# EAGLE design BreadShieldUno (EAGLE 7.1.0)
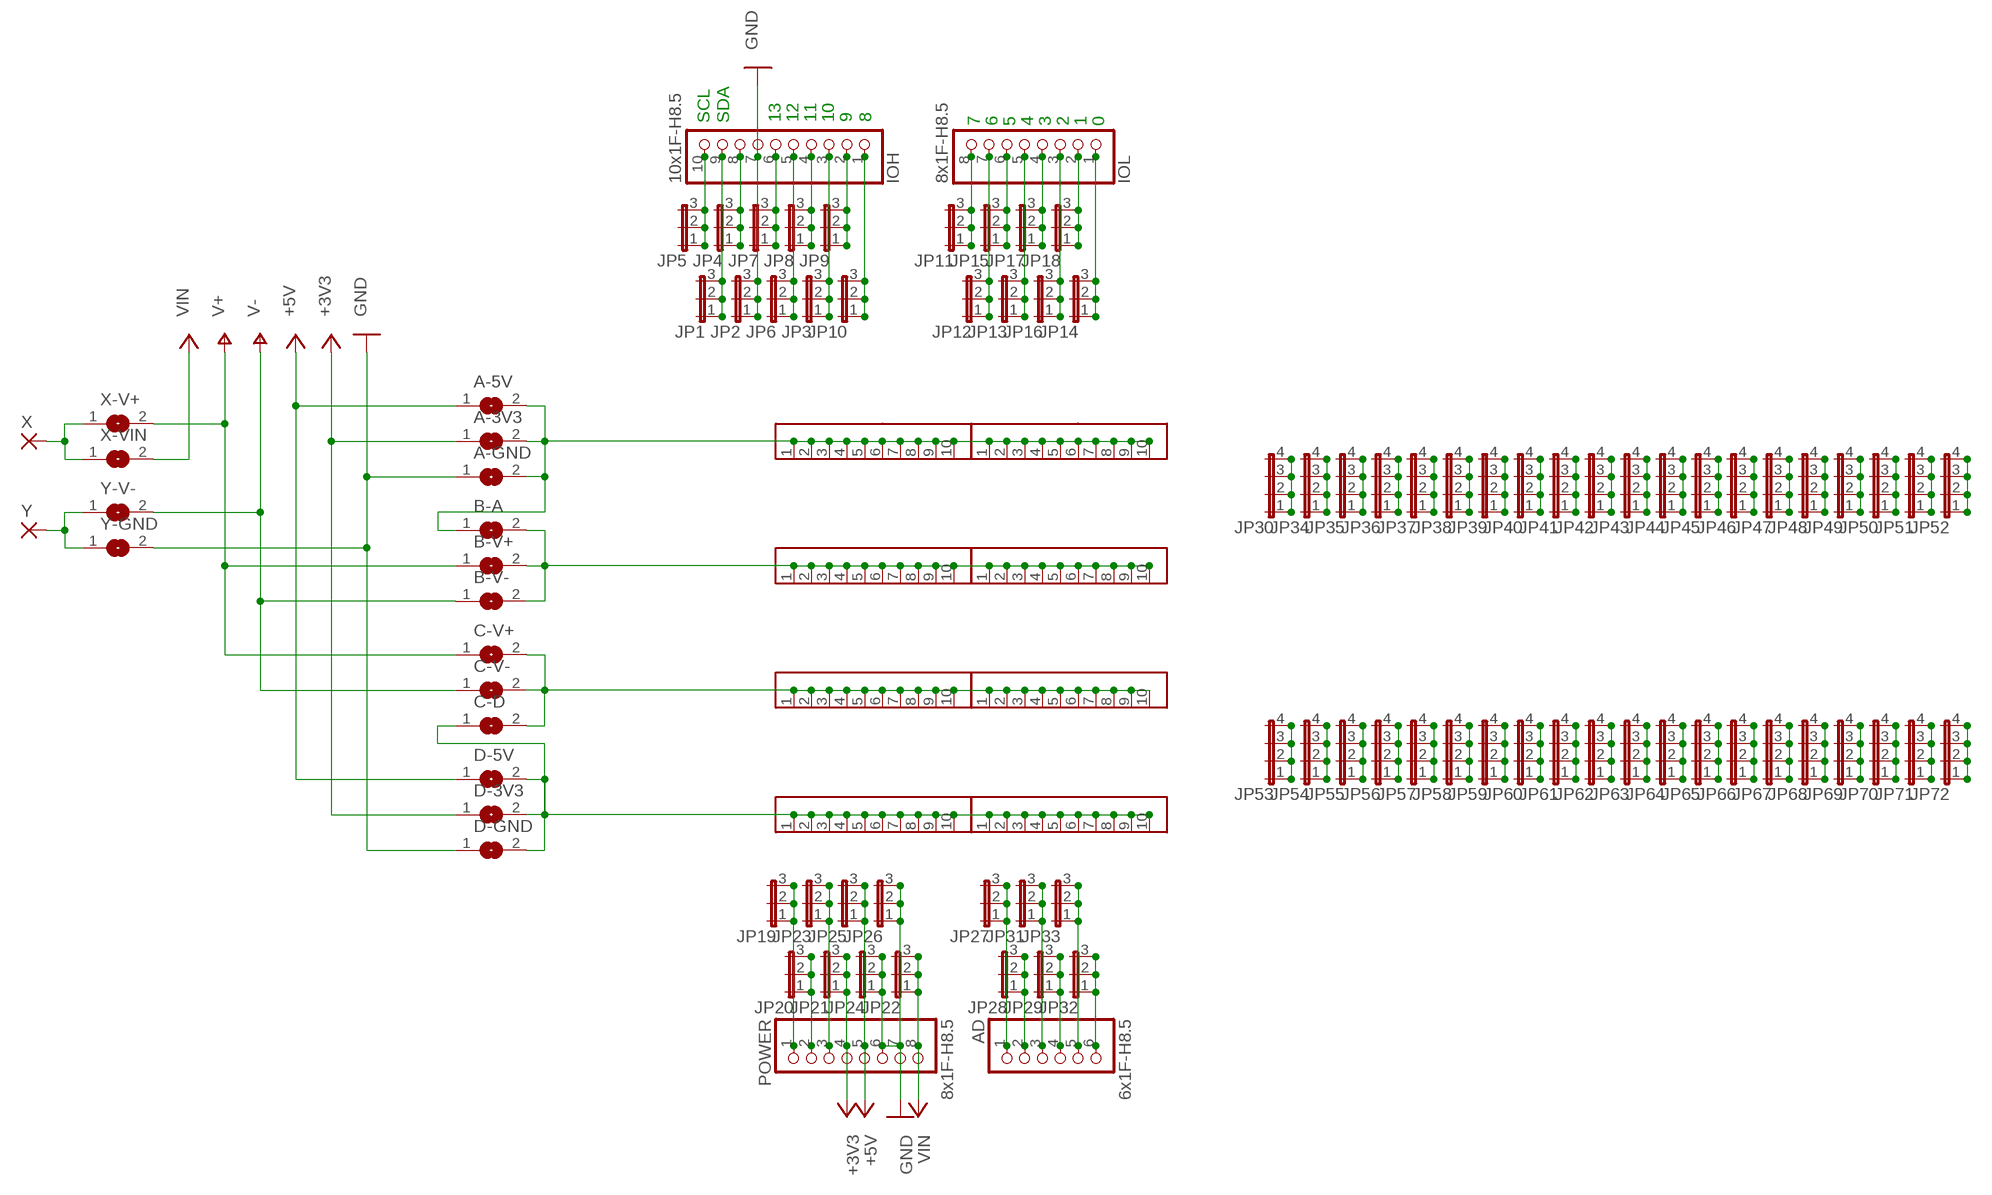
[diagram p0: schematic, sheet 1]

## Parts
A  JP10B  [JP10-1]
A2  JP10B  [JP10-1]
A-3V3  SJ  [SJ]
A-5V  SJ  [SJ]
A-GND  SJ  [SJ]
AD  6x1F-H8.5  PINHD-1X6  [1X06]
B  JP10B  [JP10-1]
B2  JP10B  [JP10-1]
B-A  SJ  [SJ]
B-V+  SJ  [SJ]
B-V-  SJ  [SJ]
C  JP10B  [JP10-1]
C2  JP10B  [JP10-1]
C-D  SJ  [SJ]
C-V+  SJ  [SJ]
C-V-  SJ  [SJ]
D  JP10B  [JP10-1]
D2  JP10B  [JP10-1]
D-3V3  SJ  [SJ]
D-5V  SJ  [SJ]
D-GND  SJ  [SJ]
IOH  10x1F-H8.5  PINHD-1X10_ARD  [1X10]
IOL  8x1F-H8.5  PINHD-1X8  [1X08]
JP1  JP2E  [JP2]
JP2  JP2E  [JP2]
JP3  JP2E  [JP2]
JP4  JP2E  [JP2]
JP5  JP2E  [JP2]
JP6  JP2E  [JP2]
JP7  JP2E  [JP2]
JP8  JP2E  [JP2]
JP9  JP2E  [JP2]
JP10  JP2E  [JP2]
JP11  JP2E  [JP2]
JP12  JP2E  [JP2]
JP13  JP2E  [JP2]
JP14  JP2E  [JP2]
JP15  JP2E  [JP2]
JP16  JP2E  [JP2]
JP17  JP2E  [JP2]
JP18  JP2E  [JP2]
JP19  JP2E  [JP2]
JP20  JP2E  [JP2]
JP21  JP2E  [JP2]
JP22  JP2E  [JP2]
JP23  JP2E  [JP2]
JP24  JP2E  [JP2]
JP25  JP2E  [JP2]
JP26  JP2E  [JP2]
JP27  JP2E  [JP2]
JP28  JP2E  [JP2]
JP29  JP2E  [JP2]
JP30  JP4E  [JP4]
JP31  JP2E  [JP2]
JP32  JP2E  [JP2]
JP33  JP2E  [JP2]
JP34  JP4E  [JP4]
JP35  JP4E  [JP4]
JP36  JP4E  [JP4]
JP37  JP4E  [JP4]
JP38  JP4E  [JP4]
JP39  JP4E  [JP4]
JP40  JP4E  [JP4]
JP41  JP4E  [JP4]
JP42  JP4E  [JP4]
JP43  JP4E  [JP4]
JP44  JP4E  [JP4]
JP45  JP4E  [JP4]
JP46  JP4E  [JP4]
JP47  JP4E  [JP4]
JP48  JP4E  [JP4]
JP49  JP4E  [JP4]
JP50  JP4E  [JP4]
JP51  JP4E  [JP4]
JP52  JP4E  [JP4]
JP53  JP4E  [JP4]
JP54  JP4E  [JP4]
JP55  JP4E  [JP4]
JP56  JP4E  [JP4]
JP57  JP4E  [JP4]
JP58  JP4E  [JP4]
JP59  JP4E  [JP4]
JP60  JP4E  [JP4]
JP61  JP4E  [JP4]
JP62  JP4E  [JP4]
JP63  JP4E  [JP4]
JP64  JP4E  [JP4]
JP65  JP4E  [JP4]
JP66  JP4E  [JP4]
JP67  JP4E  [JP4]
JP68  JP4E  [JP4]
JP69  JP4E  [JP4]
JP70  JP4E  [JP4]
JP71  JP4E  [JP4]
JP72  JP4E  [JP4]
POWER  8x1F-H8.5  PINHD-1X8  [1X08]
X  3,81/1,4  [3,81/1,4]
X-V+  SJ  [SJ]
X-VIN  SJ  [SJ]
Y  3,81/1,4  [3,81/1,4]
Y-GND  SJ  [SJ]
Y-V-  SJ  [SJ]

## Nets
+3V3: A-3V3.1 D-3V3.1 JP21.1 JP21.2 JP21.3 POWER.4
+5V: A-5V.1 D-5V.1 JP25.1 JP25.2 JP25.3 POWER.5
GND: A-GND.1 D-GND.1 IOH.7 JP2.1 JP2.2 JP2.3 JP24.1 JP24.2 JP24.3 JP26.1 JP26.2 JP26.3 POWER.6 POWER.7 Y-GND.2
GND1: IOL.5 JP13.1 JP13.2 JP13.3
GND2: AD.4 JP29.1 JP29.2 JP29.3
N$1: A2.1 A2.2 A2.3 A2.4 A2.5 A2.6 A2.7 A2.8 A2.9 A2.10 A-3V3.2 A-5V.2 A-GND.2 A.1 A.2 A.3 A.4 A.5 A.6 A.7 A.8 A.9 A.10 B-A.1
N$2: B2.1 B2.2 B2.3 B2.4 B2.5 B2.6 B2.7 B2.8 B2.9 B2.10 B-A.2 B-V+.2 B-V-.2 B.1 B.2 B.3 B.4 B.5 B.6 B.7 B.8 B.9 B.10
N$3: C2.1 C2.2 C2.3 C2.4 C2.5 C2.6 C2.7 C2.8 C2.9 C2.10 C-D.2 C-V+.2 C-V-.2 C.1 C.2 C.3 C.4 C.5 C.6 C.7 C.8 C.9 C.10
N$4: C-D.1 D2.1 D2.2 D2.3 D2.4 D2.5 D2.6 D2.7 D2.8 D2.9 D2.10 D-3V3.2 D-5V.2 D-GND.2 D.1 D.2 D.3 D.4 D.5 D.6 D.7 D.8 D.9 D.10
N$5: X-V+.1 X-VIN.1 X.1(P)
N$6: Y-GND.1 Y-V-.1 Y.1(P)
N$7: IOH.10 JP5.1 JP5.2 JP5.3
N$8: IOH.9 JP1.1 JP1.2 JP1.3
N$9: IOH.8 JP4.1 JP4.2 JP4.3
N$10: IOH.6 JP7.1 JP7.2 JP7.3
N$11: IOH.5 JP6.1 JP6.2 JP6.3
N$12: IOH.4 JP8.1 JP8.2 JP8.3
N$13: IOH.3 JP3.1 JP3.2 JP3.3
N$14: IOH.2 JP9.1 JP9.2 JP9.3
N$15: IOH.1 JP10.1 JP10.2 JP10.3
N$16: IOL.8 JP11.1 JP11.2 JP11.3
N$17: IOL.7 JP12.1 JP12.2 JP12.3
N$18: IOL.6 JP15.1 JP15.2 JP15.3
N$19: IOL.4 JP17.1 JP17.2 JP17.3
N$20: IOL.3 JP16.1 JP16.2 JP16.3
N$21: IOL.2 JP18.1 JP18.2 JP18.3
N$22: IOL.1 JP14.1 JP14.2 JP14.3
N$23: JP19.1 JP19.2 JP19.3 POWER.1
N$24: JP20.1 JP20.2 JP20.3 POWER.2
N$25: JP23.1 JP23.2 JP23.3 POWER.3
N$26: AD.1 JP27.1 JP27.2 JP27.3
N$27: AD.2 JP28.1 JP28.2 JP28.3
N$28: AD.3 JP31.1 JP31.2 JP31.3
N$29: AD.5 JP33.1 JP33.2 JP33.3
N$30: AD.6 JP32.1 JP32.2 JP32.3
N$31: JP30.1 JP30.2 JP30.3 JP30.4
N$32: JP34.1 JP34.2 JP34.3 JP34.4
N$33: JP35.1 JP35.2 JP35.3 JP35.4
N$34: JP36.1 JP36.2 JP36.3 JP36.4
N$35: JP37.1 JP37.2 JP37.3 JP37.4
N$36: JP38.1 JP38.2 JP38.3 JP38.4
N$37: JP39.1 JP39.2 JP39.3 JP39.4
N$38: JP40.1 JP40.2 JP40.3 JP40.4
N$39: JP41.1 JP41.2 JP41.3 JP41.4
N$40: JP42.1 JP42.2 JP42.3 JP42.4
N$41: JP43.1 JP43.2 JP43.3 JP43.4
N$42: JP44.1 JP44.2 JP44.3 JP44.4
N$43: JP45.1 JP45.2 JP45.3 JP45.4
N$44: JP46.1 JP46.2 JP46.3 JP46.4
N$45: JP47.1 JP47.2 JP47.3 JP47.4
N$46: JP48.1 JP48.2 JP48.3 JP48.4
N$47: JP49.1 JP49.2 JP49.3 JP49.4
N$48: JP50.1 JP50.2 JP50.3 JP50.4
N$49: JP51.1 JP51.2 JP51.3 JP51.4
N$50: JP52.1 JP52.2 JP52.3 JP52.4
N$51: JP53.1 JP53.2 JP53.3 JP53.4
N$52: JP54.1 JP54.2 JP54.3 JP54.4
N$53: JP55.1 JP55.2 JP55.3 JP55.4
N$54: JP56.1 JP56.2 JP56.3 JP56.4
N$55: JP57.1 JP57.2 JP57.3 JP57.4
N$56: JP58.1 JP58.2 JP58.3 JP58.4
N$57: JP59.1 JP59.2 JP59.3 JP59.4
N$58: JP60.1 JP60.2 JP60.3 JP60.4
N$59: JP61.1 JP61.2 JP61.3 JP61.4
N$60: JP62.1 JP62.2 JP62.3 JP62.4
N$61: JP63.1 JP63.2 JP63.3 JP63.4
N$62: JP64.1 JP64.2 JP64.3 JP64.4
N$63: JP65.1 JP65.2 JP65.3 JP65.4
N$64: JP66.1 JP66.2 JP66.3 JP66.4
N$65: JP67.1 JP67.2 JP67.3 JP67.4
N$66: JP68.1 JP68.2 JP68.3 JP68.4
N$67: JP69.1 JP69.2 JP69.3 JP69.4
N$68: JP70.1 JP70.2 JP70.3 JP70.4
N$69: JP71.1 JP71.2 JP71.3 JP71.4
N$70: JP72.1 JP72.2 JP72.3 JP72.4
V+: B-V+.1 C-V+.1 X-V+.2
V-: B-V-.1 C-V-.1 Y-V-.2
VIN: JP22.1 JP22.2 JP22.3 POWER.8 X-VIN.2

## Notes on the sheet
- SCL | SDA | 13 | 12 | 11 | 10 | 9 | 8 | 7 | 6 | 5 | 4 | 3 | 2 | 1 | 0

## Library data of the parts
A A2 B B2 C C2 D D2 = jumper:JP10B
A-3V3 A-5V A-GND B-A B-V+ B-V- C-D C-V+ C-V- D-3V3 D-5V D-GND X-V+ X-VIN Y-GND Y-V- = jumper:SJ: SMD solder JUMPER
AD = SmartPrj:PINHD-1X6: PIN HEADER
IOH = SmartPrj:PINHD-1X10_ARD: PIN HEADER
IOL POWER = SmartPrj:PINHD-1X8: PIN HEADER
JP1-JP29 JP31-JP33 = jumper:JP2E: JUMPER
JP30 JP34-JP72 = jumper:JP4E: JUMPER
X Y = wirepad:3,81/1,4: THROUGH-HOLE PAD

## Net classes
0 default: width 0.254 mm, clearance 0.254 mm
1 power: width 0.61 mm, drill 0.61 mm, clearance 0.254 mm
2 gnd: width 0.305 mm, drill 0.559 mm, clearance 0.254 mm
3 usbvcc: width 0.508 mm, drill 0.61 mm, clearance 0.254 mm
4 aref: width 0.406 mm, drill 0.61 mm, clearance 0.254 mm

## Board
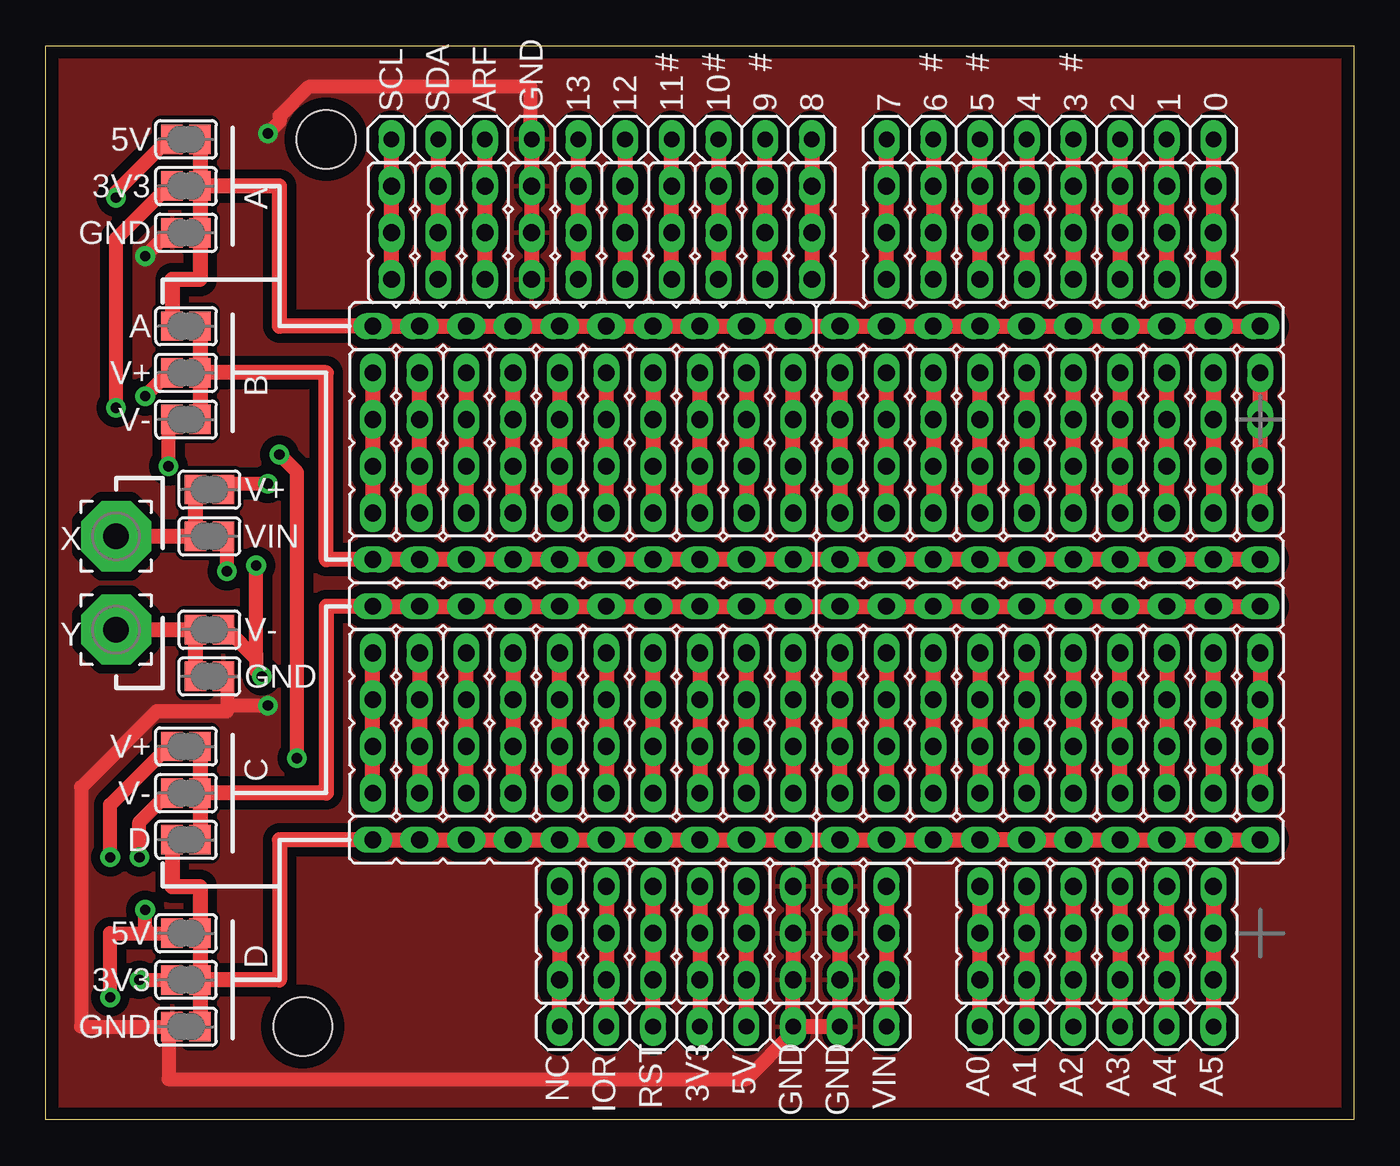
[diagram p1: board, top side]
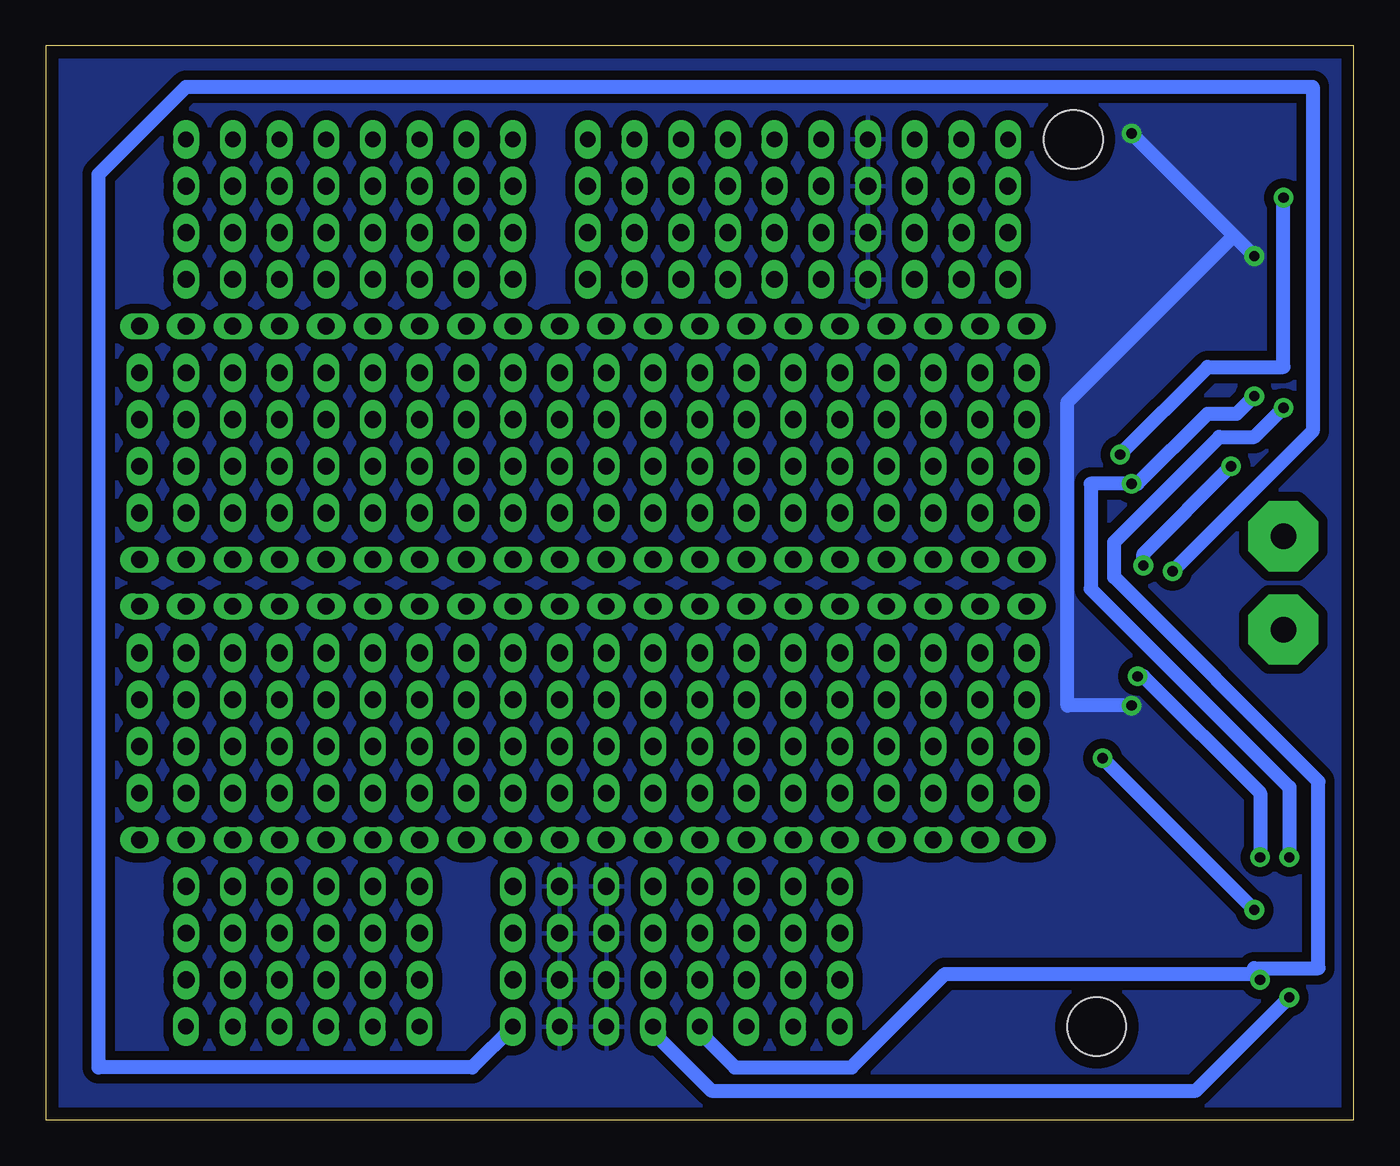
[diagram p2: board, bottom side, seen from below]

Size 71.12 x 58.42 mm. Coordinates in mm from the lower left corner, seen from the top.
Outline: 0,0 0,58.42 71.12,58.42 71.12,0 0,0
Copper layers (1*16): Top 0.035mm / dielectric 1.5mm / Bottom 0.035mm
Design rules "default *": minimum track width 30mil, minimum drill 22mil, track to track 20mil, track to pad 20mil, pad to pad 10mil, via to via 12mil, smd to smd 8mil, copper to edge 26mil, drill to drill 12mil, minimum pad ring 10mil, minimum via ring 10mil, stop-mask expansion 1mil, vias tented up to drill 30mil, thermal gap 10mil
Holes 3.2 mm at 15.24,53.34 13.97,5.08
vRestrict: area 22.9,46.6 to 24.6,51.7; area 25.4,48 to 27.1,51.7; area 28.4,47.9 to 29.6,51.3; area 31,47.9 to 32.1,51.3; area 33.5,47.9 to 34.7,51.3; area 36.1,47.9 to 37.2,51.3; area 38.7,49.8 to 39.9,51.3; area 40.3,47.6 to 47.6,49.4; area 60.3,46.7 to 61.7,49.3; area 62.9,46.7 to 64.3,49.3; area 61.3,38.4 to 64.8,39.8; area 0.6,24.4 to 2,32.6; 14 more areas

### Footprints (pad centres in the part's own frame; a part is rotated, then mirrored left to right if it is on the bottom)
JP10-1 = drill 0.914 long: 1 -10.16,0; 2 -7.62,0; 3 -5.08,0; 4 -2.54,0; 5 0,0; 6 2.54,0; 7 5.08,0; 8 7.62,0; 9 10.16,0; 10 12.7,0
SJ = smd 1.168 x 1.6: 1 -0.762,0; 2 0.762,0
1X06 = drill 0.85 pad 1.422 long: 1 -6.35,0; 2 -3.81,0; 3 -1.27,0; 4 1.27,0; 5 3.81,0; 6 6.35,0
1X10 = drill 0.85 pad 1.422 long: 1 -11.43,0; 2 -8.89,0; 3 -6.35,0; 4 -3.81,0; 5 -1.27,0; 6 1.27,0; 7 3.81,0; 8 6.35,0; 9 8.89,0; 10 11.43,0
1X08 = drill 0.85 pad 1.422 long: 1 -8.89,0; 2 -6.35,0; 3 -3.81,0; 4 -1.27,0; 5 1.27,0; 6 3.81,0; 7 6.35,0; 8 8.89,0
JP2 = drill 0.914 long: 1 -2.54,0; 2 0,0; 3 2.54,0
JP4 = drill 0.914 long: 1 -3.81,0; 2 -1.27,0; 3 1.27,0; 4 3.81,0
3,81/1,4 = drill 1.397 pad 3.81 octagon: 1 0,0

### Placement (x,y rotation side)
A  27.94,43.18 0 top
A2  53.34,43.18 0 top
A-3V3  7.62,50.8 0 top
A-5V  7.62,53.34 0 top
A-GND  7.62,48.26 0 top
AD  57.15,5.08 0 top
B  27.94,30.48 0 top
B2  53.34,30.48 0 top
B-A  7.62,43.18 0 top
B-V+  7.62,40.64 0 top
B-V-  7.62,38.1 0 top
C  27.94,27.94 0 top
C2  53.34,27.94 0 top
C-D  7.62,15.24 0 top
C-V+  7.62,20.32 0 top
C-V-  7.62,17.78 0 top
D  27.94,15.24 0 top
D2  53.34,15.24 0 top
D-3V3  7.62,7.62 0 top
D-5V  7.62,10.16 0 top
D-GND  7.62,5.08 0 top
IOH  30.23,53.34 180 top
IOL  54.61,53.34 180 top
JP1  21.34,48.26 90 top
JP2  26.42,48.26 90 top
JP3  36.58,48.26 90 top
JP4  23.88,48.26 90 top
JP5  18.8,48.26 90 top
JP6  31.5,48.26 90 top
JP7  28.96,48.26 90 top
JP8  34.04,48.26 90 top
JP9  39.12,48.26 90 top
JP10  41.66,48.26 90 top
JP11  45.72,48.26 90 top
JP12  48.26,48.26 90 top
JP13  53.34,48.26 90 top
JP14  63.5,48.26 90 top
JP15  50.8,48.26 90 top
JP16  58.42,48.26 90 top
JP17  55.88,48.26 90 top
JP18  60.96,48.26 90 top
JP19  27.94,10.16 90 top
JP20  30.48,10.16 90 top
JP21  35.56,10.16 90 top
JP22  45.72,10.16 270 top
JP23  33.02,10.16 90 top
JP24  40.64,10.16 270 top
JP25  38.1,10.16 90 top
JP26  43.18,10.16 90 top
JP27  50.8,10.16 90 top
JP28  53.34,10.16 90 top
JP29  58.42,10.16 90 top
JP30  17.78,36.83 90 top
JP31  55.88,10.16 90 top
JP32  63.5,10.16 90 top
JP33  60.96,10.16 90 top
JP34  20.32,36.83 90 top
JP35  22.86,36.83 90 top
JP36  17.78,21.59 90 top
JP37  20.32,21.59 90 top
JP38  22.86,21.59 90 top
JP39  25.4,21.59 90 top
JP40  27.94,21.59 90 top
JP41  30.48,21.59 90 top
JP42  33.02,21.59 90 top
JP43  35.56,21.59 90 top
JP44  38.1,21.59 90 top
JP45  40.64,21.59 90 top
JP46  43.18,21.59 90 top
JP47  48.26,21.59 90 top
JP48  45.72,21.59 90 top
JP49  27.94,36.83 90 top
JP50  25.4,36.83 90 top
JP51  33.02,36.83 90 top
JP52  30.48,36.83 90 top
JP53  40.64,36.83 90 top
JP54  38.1,36.83 90 top
JP55  35.56,36.83 90 top
JP56  43.18,36.83 90 top
JP57  45.72,36.83 90 top
JP58  48.26,36.83 90 top
JP59  50.8,36.83 90 top
JP60  58.42,21.59 90 top
JP61  53.34,21.59 90 top
JP62  53.34,36.83 90 top
JP63  55.88,21.59 90 top
JP64  50.8,21.59 90 top
JP65  58.42,36.83 90 top
JP66  55.88,36.83 90 top
JP67  60.96,36.83 90 top
JP68  66.04,21.59 90 top
JP69  63.5,21.59 90 top
JP70  60.96,21.59 90 top
JP71  63.5,36.83 90 top
JP72  66.04,36.83 90 top
POWER  36.83,5.08 0 top
X  3.81,31.75 0 top
X-V+  8.89,34.29 0 top
X-VIN  8.89,31.75 0 top
Y  3.81,26.67 0 top
Y-GND  8.89,24.13 0 top
Y-V-  8.89,26.67 0 top

### Tracks (layer width: path | path; a pad name or v marks a point on that pad's centre or on a via)
+3V3  (via drill 0.56)
  Top 0.762: v5.08,7.62 6.67,7.62 D-3V3.1 | v3.81,38.73 3.81,47.94 6.67,50.8 A-3V3.1
  Top 0.813: JP21.3 JP21.2 JP21.1 POWER.4
  Bottom 0.762: 5.4,7.94 v5.08,7.62 | 5.4,7.94 22.23,7.94 27.3,2.86 33.66,2.86 35.56,4.76 POWER.4 | v3.81,38.73 5.4,37.15 7.3,37.15 13.02,31.43 13.02,29.53 1.91,18.41 1.91,8.25 5.4,8.25 5.4,7.94
+5V  (via drill 0.56)
  Top 0.762: 5.4,10.16 3.49,10.16 v3.49,6.67 | 5.4,10.16 6.67,10.16 D-5V.1 | v3.81,50.16 3.81,50.48 6.67,53.34 A-5V.1 | v12.7,36.2 13.65,35.24 v13.65,19.68 | v5.4,11.43 5.4,10.48 5.4,10.16
  Top 0.813: POWER.5 JP25.1 JP25.2 JP25.3
  Bottom 0.762: v3.49,6.67 8.57,1.59 34.92,1.59 38.1,4.76 POWER.5 | v3.81,50.16 3.81,40.96 7.94,40.96 v12.7,36.2 | v5.4,11.43 v13.65,19.68
GND  (via drill 0.56)
  Top 0.762: v5.4,46.99 6.67,48.26 A-GND.1 | v12.06,53.66 12.7,54.29 12.7,54.61 14.29,56.2 26.35,56.2 26.35,53.66 IOH.7 | 9.84,22.54 9.84,24.13 Y-GND.2 | 9.84,22.54 9.84,22.22 6.03,22.22 1.91,18.1 1.91,5.08 6.67,5.08 D-GND.1 6.67,4.76 6.67,2.22 38.1,2.22 40.64,4.76 POWER.6 | v12.06,22.54 10.16,22.54 9.84,22.54
  Top 0.813: JP24.1 JP24.2 JP24.3 POWER.6 POWER.7 | POWER.7 JP26.1 JP26.2 JP26.3 POWER.7 | IOH.7 JP2.3 JP2.2 JP2.1
  Bottom 0.762: v12.06,53.66 6.51,48.1 | 6.51,48.1 v5.4,46.99 | v12.06,22.54 15.56,22.54 15.56,39.05 6.67,47.94 6.51,48.1
  pour Bottom (rank 2): 0.64,57.78 0.64,0.64 70.48,0.64 70.48,57.78
  pour Top (rank 2): 0.64,57.78 0.64,0.64 70.48,0.64 70.48,57.78
GND1
  Top 0.813: IOL.5 JP13.3 JP13.2 JP13.1
GND2
  Top 0.813: JP29.3 JP29.2 JP29.1 AD.4
N$1
  Top 0.508: 8.26,50.93 A-3V3.2 | 8.26,53.21 A-5V.2
  Top 0.813: A2.10 A2.9 A2.8 A2.7 A2.6 A2.5 A2.4 A2.3 A2.2 A2.1 A.10 A.9 A.8 A.7 A.6 A.5 A.4 A.3 A.2 A.1 12.7,43.18 12.7,50.8 A-3V3.2 | 8.26,53.21 8.38,53.21 A-3V3.2 | A-3V3.2 A-GND.2 8.38,45.72 6.86,45.72 B-A.1
N$2
  Top 0.508: 8.26,38.35 B-V-.2 | 8.26,42.93 B-A.2 | 8.26,40.64 B-V+.2 8.26,40.64
  Top 0.813: B2.10 B2.9 B2.8 B2.7 B2.6 B2.5 B2.4 B2.3 B2.2 B2.1 B.10 B.9 B.8 B.7 B.6 B.5 B.4 B.3 B.2 B.1 15.24,30.48 15.24,40.64 B-V+.2 | 8.26,42.93 8.38,42.93 B-V+.2 | B-V+.2 B-V-.2
N$3
  Top 0.508: 8.26,15.49 C-D.2 | 8.26,20.07 C-V+.2 | 8.26,17.78 C-V-.2 8.26,17.78
  Top 0.813: C2.10 C2.9 C2.8 C2.7 C2.6 C2.5 C2.4 C2.3 C2.2 C2.1 C.10 C.9 C.8 C.7 C.6 C.5 C.4 C.3 C.2 C.1 15.24,27.94 15.24,17.78 C-V-.2 | 8.26,20.07 8.38,20.07 C-V-.2 | C-V-.2 C-D.2
N$4
  Top 0.508: 8.26,5.21 D-GND.2 | 8.26,7.49 D-3V3.2
  Top 0.813: D2.10 D2.9 D2.8 D2.7 D2.6 D2.5 D2.4 D2.3 D2.2 D2.1 D.10 D.9 D.8 D.7 D.6 D.5 D.4 D.3 D.2 D.1 12.7,15.24 12.7,7.62 D-3V3.2 D-5V.2 8.38,12.57 8.38,12.7 6.86,12.7 C-D.1 | 8.26,7.49 8.38,7.49 D-GND.2
N$5
  Top 0.813: X-V+.1 X-VIN.1 X.1
N$6
  Top 0.508: 8,24.26 Y-GND.1 | 8,26.54 Y-V-.1
  Top 0.813: 8,26.54 8.13,26.54 Y-GND.1 | Y.1 Y-V-.1
N$7
  Top 0.813: JP5.1 JP5.2 JP5.3 IOH.10
N$8
  Top 0.813: IOH.9 JP1.3 JP1.2 JP1.1
N$9
  Top 0.813: JP4.1 JP4.2 JP4.3 IOH.8
N$10
  Top 0.813: JP7.1 JP7.2 JP7.3 IOH.6
N$11
  Top 0.813: IOH.5 JP6.3 JP6.2 JP6.1
N$12
  Top 0.813: JP8.1 JP8.2 JP8.3 IOH.4
N$13
  Top 0.813: IOH.3 JP3.3 JP3.2 JP3.1
N$14
  Top 0.813: JP9.1 JP9.2 JP9.3 IOH.2
N$15
  Top 0.813: IOH.1 JP10.3 JP10.2 JP10.1
N$16
  Top 0.813: JP11.1 JP11.2 JP11.3 IOL.8
N$17
  Top 0.813: IOL.7 JP12.3 JP12.2 JP12.1
N$18
  Top 0.813: JP15.1 JP15.2 JP15.3 IOL.6
N$19
  Top 0.813: JP17.1 JP17.2 JP17.3 IOL.4
N$20
  Top 0.813: IOL.3 JP16.3 JP16.2 JP16.1
N$21
  Top 0.813: JP18.1 JP18.2 JP18.3 IOL.2
N$22
  Top 0.813: IOL.1 JP14.3 JP14.2 JP14.1
N$23
  Top 0.813: POWER.1 JP19.1 JP19.2 JP19.3
N$24
  Top 0.813: JP20.3 JP20.2 JP20.1 POWER.2
N$25
  Top 0.813: POWER.3 JP23.1 JP23.2 JP23.3
N$26
  Top 0.813: AD.1 JP27.1 JP27.2 JP27.3
N$27
  Top 0.813: JP28.3 JP28.2 JP28.1 AD.2
N$28
  Top 0.813: AD.3 JP31.1 JP31.2 JP31.3
N$29
  Top 0.813: AD.5 JP33.1 JP33.2 JP33.3
N$30
  Top 0.813: JP32.3 JP32.2 JP32.1 AD.6
N$31
  Top 0.813: JP30.4 JP30.3 JP30.2 JP30.1
N$32
  Top 0.813: JP34.1 JP34.2 JP34.3 JP34.4
N$33
  Top 0.813: JP35.4 JP35.3 JP35.2 JP35.1
N$34
  Top 0.813: JP36.1 JP36.2 JP36.3 JP36.4
N$35
  Top 0.813: JP37.4 JP37.3 JP37.2 JP37.1
N$36
  Top 0.813: JP38.1 JP38.2 JP38.3 JP38.4
N$37
  Top 0.813: JP39.4 JP39.3 JP39.2 JP39.1
N$38
  Top 0.813: JP40.1 JP40.2 JP40.3 JP40.4
N$39
  Top 0.813: JP41.4 JP41.3 JP41.2 JP41.1
N$40
  Top 0.813: JP42.1 JP42.2 JP42.3 JP42.4
N$41
  Top 0.813: JP43.4 JP43.3 JP43.2 JP43.1
N$42
  Top 0.813: JP44.1 JP44.2 JP44.3 JP44.4
N$43
  Top 0.813: JP45.4 JP45.3 JP45.2 JP45.1
N$44
  Top 0.813: JP46.1 JP46.2 JP46.3 JP46.4
N$45
  Top 0.813: JP47.1 JP47.2 JP47.3 JP47.4
N$46
  Top 0.813: JP48.4 JP48.3 JP48.2 JP48.1
N$47
  Top 0.813: JP49.4 JP49.3 JP49.2 JP49.1
N$48
  Top 0.813: JP50.1 JP50.2 JP50.3 JP50.4
N$49
  Top 0.813: JP51.4 JP51.3 JP51.2 JP51.1
N$50
  Top 0.813: JP52.1 JP52.2 JP52.3 JP52.4
N$51
  Top 0.813: JP53.1 JP53.2 JP53.3 JP53.4
N$52
  Top 0.813: JP54.4 JP54.3 JP54.2 JP54.1
N$53
  Top 0.813: JP55.1 JP55.2 JP55.3 JP55.4
N$54
  Top 0.813: JP56.4 JP56.3 JP56.2 JP56.1
N$55
  Top 0.813: JP57.1 JP57.2 JP57.3 JP57.4
N$56
  Top 0.813: JP58.4 JP58.3 JP58.2 JP58.1
N$57
  Top 0.813: JP59.1 JP59.2 JP59.3 JP59.4
N$58
  Top 0.813: JP60.1 JP60.2 JP60.3 JP60.4
N$59
  Top 0.813: JP61.1 JP61.2 JP61.3 JP61.4
N$60
  Top 0.813: JP62.4 JP62.3 JP62.2 JP62.1
N$61
  Top 0.813: JP63.4 JP63.3 JP63.2 JP63.1
N$62
  Top 0.813: JP64.4 JP64.3 JP64.2 JP64.1
N$63
  Top 0.813: JP65.4 JP65.3 JP65.2 JP65.1
N$64
  Top 0.813: JP66.1 JP66.2 JP66.3 JP66.4
N$65
  Top 0.813: JP67.1 60.96,34.92 JP67.2 JP67.3 JP67.4
N$66
  Top 0.813: JP68.4 JP68.3 JP68.2 JP68.1
N$67
  Top 0.813: JP69.1 JP69.2 JP69.3 JP69.4
N$68
  Top 0.813: JP70.4 JP70.3 JP70.2 JP70.1
N$69
  Top 0.813: JP71.4 JP71.3 JP71.2 JP71.1
N$70
  Top 0.813: JP72.1 JP72.2 JP72.3 JP72.4
V+  (via drill 0.56)
  Top 0.762: v3.49,14.29 3.49,17.14 6.67,20.32 C-V+.1 | v12.06,34.61 9.84,34.61 9.84,34.29 X-V+.2 | v5.4,39.37 6.67,40.64 B-V+.1
  Bottom 0.762: v3.49,14.29 3.49,18.1 14.29,28.89 14.29,34.61 v12.06,34.61 11.75,34.61 7.94,38.42 6.35,38.42 v5.4,39.37
V-  (via drill 0.56)
  Top 0.762: v5.08,14.29 5.08,16.19 6.67,17.78 C-V-.1 | v11.75,24.13 11.43,24.45 11.43,25.08 | 11.43,25.08 9.84,26.67 Y-V-.2 | v6.67,35.56 6.67,38.1 B-V-.1 | v11.43,30.16 11.43,25.4 11.43,25.08
  Bottom 0.762: v5.08,14.29 5.08,17.78 11.43,24.13 v11.75,24.13 | v6.67,35.56 11.43,30.8 v11.43,30.16
VIN  (via drill 0.56)
  Top 0.762: v9.84,29.84 9.84,31.75 X-VIN.2
  Top 0.813: JP22.1 JP22.2 JP22.3 POWER.8
  Bottom 0.762: v9.84,29.84 2.22,37.46 2.22,56.2 63.5,56.2 68.26,51.44 68.26,2.86 47.94,2.86 POWER.8

### Text on the board
tNames: # | # | # | # | # | # | SCL | SDA | ARF | GND | 13 | 12 | 11 | 10 | 9 | 8 | 7 | 6 | 5 | 4 | 3 | 2 | 1 | 0 | 5V | 3V3 | A | GND | A | V+ | B | V- | V+ | VIN | V- | GND | V+ | V- | C | D | 5V | 3V3 | D | GND | RST | 3V3 | GND | GND | NC | IOR | 5V | VIN | A0 | A1 | A2 | A3 | A4 | A5
ReferenceLC: L | TX | ON | RX | PC1 | PC2
tDocu: DIGITAL | [#=PWM] | TX> | RX< | ANALOG IN
214bmp: D:/SmartProjects/Snc/a4_bn_logo2.bmp